# Altium schematic sheet Sheet2.SchDoc
size A; SheetNumber: 2; SheetTotal: 2
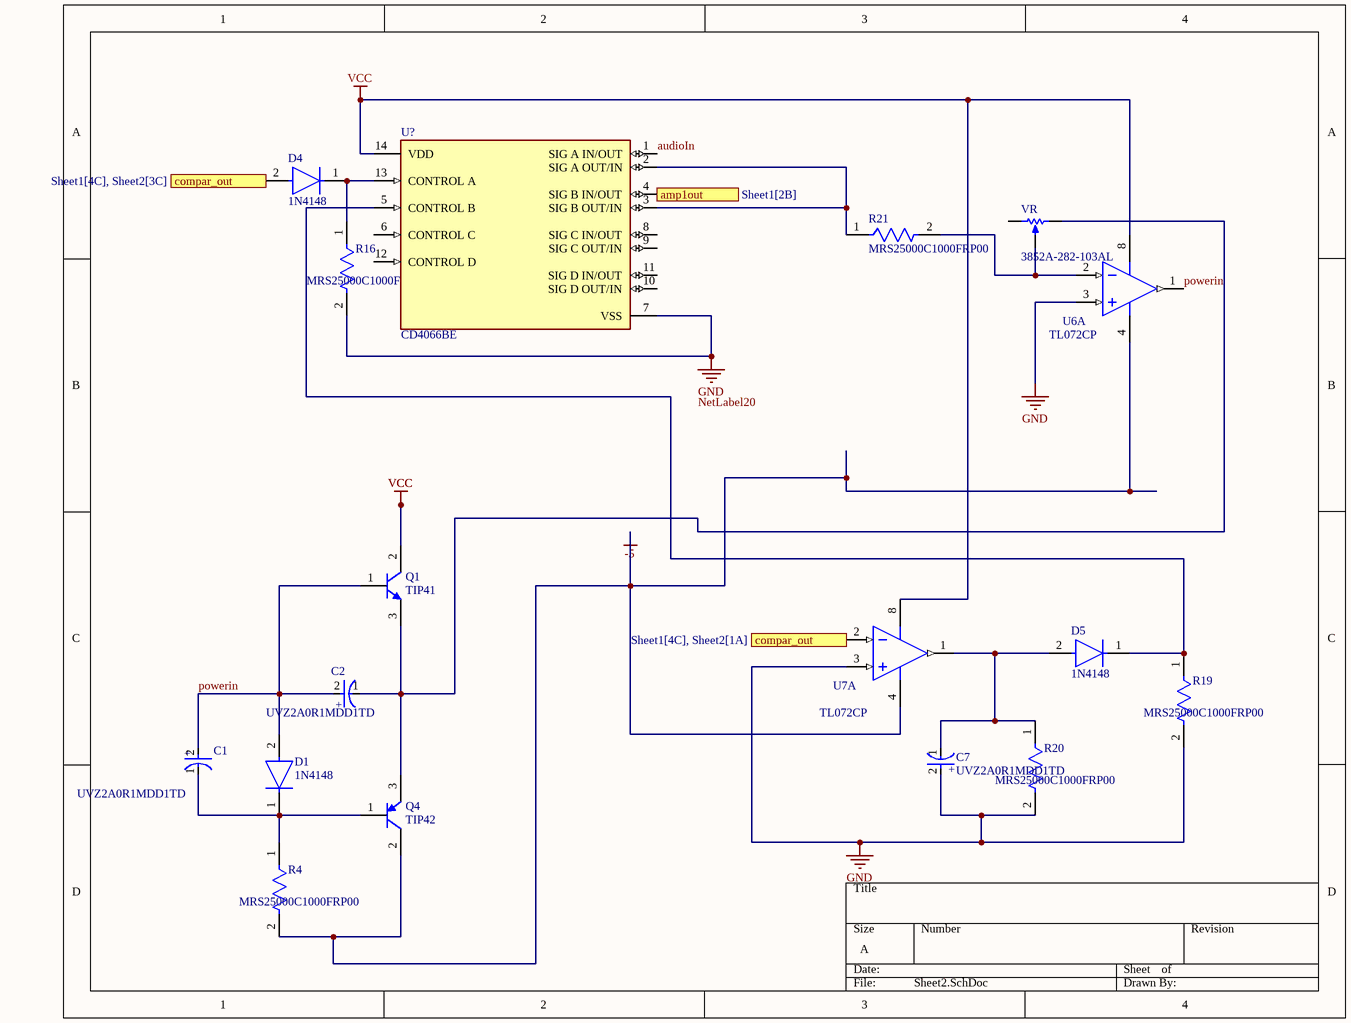
[diagram p0: Sheet2.SchDoc]

## Parts
C1  UVZ2A0R1MDD1TD  [FP-UVZ2A0R1MDD1TD-MFG]
C2  UVZ2A0R1MDD1TD  [FP-UVZ2A0R1MDD1TD-MFG]
C7  UVZ2A0R1MDD1TD  [FP-UVZ2A0R1MDD1TD-MFG]
D1  1N4148  [FP-017AG-MFG]
D4  1N4148  [FP-017AG-MFG]
D5  1N4148  [FP-017AG-MFG]
Q1  TIP41  [ONSC-TO-220-3-221A-09]
Q4  TIP42  [ONSC-TO-220-3-221A-09]
R4  MRS25000C1000FRP00  [FP-MRS25-MFG]
R16  MRS25000C1000FRP00  [FP-MRS25-MFG]
R19  MRS25000C1000FRP00  [FP-MRS25-MFG]
R20  MRS25000C1000FRP00  [FP-MRS25-MFG]
R21  MRS25000C1000FRP00  [FP-MRS25-MFG]
U6  TL072CP  [P0008A]  (part A of 2)
U7  TL072CP  [P0008A]  (part A of 2)
U?  CD4066BE  [FP-N0014A-MFG]
VR  3852A-282-103AL  [BOUR-3852A-282-103AL-3_V]

## Ports
amp1out (in, see Sheet1[2B]), compar_out (in, see Sheet1[4C], Sheet2[1A]), compar_out (in, see Sheet1[4C], Sheet2[3C])

## Nets
-5: Q4.2(C) R4.2 U6.4(VCC-) U7.4(VCC-)
GND: C7.2(A) R16.2 R19.2 R20.2 U6.3(IN1+) U7.3(IN1+) U?.7(VSS)
VCC: Q1.2(C) U6.8(VCC+) U7.8(VCC+) U?.14(VDD)
amp1out: U?.4(SIG_B_IN/OUT) ; port amp1out
audioIn: U?.1(SIG_A_IN/OUT)
compar_out: D4.2(A) U7.2(IN1-) ; port compar_out
powerin: C1.2(A) C2.2(A) D1.2(A) Q1.1(B) U6.1(OUT1)
NetC1_1: C1.1(C) D1.1(C) Q4.1(B) R4.1
NetC2_1: C2.1(C) Q1.3(E) Q4.3(E) VR.3(CW)
NetC7_1: C7.1(C) D5.2(A) R20.1 U7.1(OUT1)
NetD4_1: D4.1(C) R16.1 U?.13(CONTROL_A)
NetD5_1: D5.1(C) R19.1 U?.5(CONTROL_B)
NetR21_1: R21.1 U?.2(SIG_A_OUT/IN) U?.3(SIG_B_OUT/IN)
NetR21_2: R21.2 U6.2(IN1-) VR.2(S)

Not connected (* = marked no-connect by the designer): U? 6(CONTROL_C) 8(SIG_C_IN/OUT) 9(SIG_C_OUT/IN) 10(SIG_D_OUT/IN) 11(SIG_D_IN/OUT) 12(CONTROL_D); VR 1(CCW)

## Notes on the sheet
- Labels drawn without touching a wire or pin: NetLabel20
- (in symbol CMP-00267-12792183-1) +

## Library data of the parts
C1 C2 C7 = CMP-00267-12792183-1: UVZ2A0R1MDD1TD Cap Alum 0.1UF 20% 100V Radial; Capacitance: 100nF; Leakage Current: 300nA; Ripple Current: 1.5mA; Dielectric Material: Aluminium; Life (Hours): 1000hours; Dissipation Factor: 8%; Voltage Rating: 100V; Height: 11mm; Tolerance: 20%; Mount: Through Hole; Case/Package: Radial; Voltage Rating (DC): 100V; NexarPartId: 12792183; Number of Pins: 2; Max Operating Temperature: 105°C; Height - Seated (Max): 12.4968mm; Diameter: 5mm; RoHS: Compliant; Lead Pitch: 2.0066mm; Min Operating Temperature: -55°C
D1 D4 D5 = CMP-07163-000046-1: DIODE GEN PURP 100V 200MA DO35; Forward Voltage: 1V; Max Power Dissipation: 500mW; Max Reverse Current: 5uA; Forward Current: 300mA; Current: 4A; Reverse Recovery Time: 4ns; Element Configuration: Single; Outside Diameter: 1.85mm; Capacitance: 4pF; Polarity: Standard; Max Forward Surge Current (Ifsm): 1A; Reverse Voltage: 100V; Output Current: 200mA; Average Rectified Current: 200mA; Diameter: 1.91mm; Max Repetitive Reverse Voltage (Vrrm): 100V; Current Rating: 200mA; Case/Package: DO-35; Lead Free: Lead Free; Number of Pins: 2; Recovery Time: 4ns; Packaging: Bulk; Contact Plating: Tin; Voltage: 100V; Mount: Through Hole; Max Surge Current: 4A; Package Quantity: 2000; Width: 1.91mm; Max Reverse Voltage (DC): 100V; Length: 4.56mm; Radiation Hardening: No; Power Dissipation: 500mW; Voltage Rating (DC): 100V; Peak Non-Repetitive Surge Current: 4A; REACH SVHC: No SVHC; Height: 4.56mm; Max Operating Temperature: 175°C; Series: -; Weight: 0.01lb; Min Operating Temperature: -65°C
Q1 = CMP-1048-01097-1: Complementary Silicon Plastic Power Transistor, 3-Pin TO-220, Tube; Manufacturer: On Semiconductor; IC Continuous (A): 6; Note1: 0; fT Min (MHz): 3; Polarity: NPN; ComponentLink1Description: Manufacturer URL; ComponentLink3Description: Package Specification; ComponentLink2Description: Datasheet; ComponentLink1URL: http://www.onsemi.com/; PartNumber: TIP41; PackageReference: TO-220-3-221A-09; Packing: Tube; Mounting Technology: Through Hole; PackageDescription: 3-Pin Flange Mount, Vertical Straight Lead, Body 9.97 x 4.445 mm, Pitch 2.54 mm; ComponentLink2URL: http://www.onsemi.com/pub_link/Collateral/TIP41A-D.PDF; ComponentLink3URL: http://www.onsemi.com/pub_link/Collateral/221A-09.PDF; DatasheetVersion: Rev. 10; PackageVersion: Rev. AG, 09/2011; RoHS: FALSE
Q4 = CMP-1048-01181-1: Complementary Silicon Plastic Power Transistor, 3-Pin TO-220, Tube; Manufacturer: On Semiconductor; Polarity: PNP; fT Min (MHz): 3; IC Continuous (A): 6; PackageReference: TO-220-3-221A-09; ComponentLink3Description: Package Specification; PartNumber: TIP42; ComponentLink2URL: http://www.onsemi.com/pub_link/Collateral/TIP41A-D.PDF; PackageDescription: 3-Pin Flange Mount, Vertical Straight Lead, Body 9.97 x 4.445 mm, Pitch 2.54 mm; Mounting Technology: Through Hole; DatasheetVersion: Rev. 10; RoHS: FALSE; ComponentLink1Description: Manufacturer URL; ComponentLink2Description: Datasheet; ComponentLink1URL: http://www.onsemi.com/; ComponentLink3URL: http://www.onsemi.com/pub_link/Collateral/221A-09.PDF; PackageVersion: Rev. AG, 09/2011; Packing: Tube
R4 R16 R19-R21 = CMP-00030-42757237-1: MRS25000C1000FRP00 Resistor, 100 Ohm, ± 1%, 600 mW, Axial Leaded, Metal Film (Thin Film), Professional; Max Power Dissipation: 600mW; Resistance: 100Ω; Voltage Rating: 350V; Temperature Coefficient: 50ppm/°C; Lead Diameter: 600µm; RoHS: Compliant; Radiation Hardening: No; Schedule B: 8533210090, 8533210090; Length: 6.5mm; Packaging: Tape & Reel (TR); Number of Terminations: 2; Mount: Through Hole; Width: 2.5mm; Tolerance: 1%; Military Standard: Not; Voltage Rating (DC): 350V; Contact Plating: Tin; Number of Pins: 2; Max Operating Temperature: 155°C; NexarPartId: 42757237; Diameter: 2.5mm; Composition: Metal Film, Thin Film; REACH SVHC: Unknown; Power Rating: 600mW; Lead Free: Lead Free; Termination: Axial; Case/Package: Axial; Min Operating Temperature: -55°C
U6 U7 = CMP-0017-00950-2: Dual Low-Noise JFET-Input General-Purpose Operational Amplifier, 7 to 36 V, 0 to 70 degC, 8-pin DIP (P8), Pb-Free (RoHS); Manufacturer: Texas Instruments; Sub Family: General Purpose Amplifier, High Supply Voltage Amplifier (>=30V); Total Supply Voltage(Max)(+5V is 5, +/-5V is 10): 36; Slew Rate(Typ)(V/us): 13; Vn at 1kHz(Typ)(nV/rtHz): 18; GBW(Typ)(MHz): 3; CMRR(Min)(dB): 70; Total Supply Voltage(Min)(+5V is 5, +/-5V is 10): 7; Vio (25C)(Max)(mV): 10; Rating: Catalog; IIB(Max)(pA): 200; Iq per channel(Max)(mA): 2.5; Number of Channels: 2; Mounting Technology: Through Hole; ComponentLink3Description: Package Specification; PartNumber: TL072CP; PackageVersion: 4040082/E, 04/2010; Eco-Plan: Pb-Free (RoHS); DatasheetVersion: SLOS080J; Offset Drift(Typ)(uV/C): 18; ComponentLink3URL: http://www.ti.com/litv/pdf/mpdi001b; PackageDescription: 8-Pin Plastic In-Line, Body 9.59 x 6.35 mm, Pitch 2.54 mm; Code_JEDEC: MS-001; ComponentLink2URL: http://www.ti.com/lit/ds/symlink/tl072.pdf; ComponentLink1Description: Manufacturer URL; ComponentLink2Description: Datasheet; ComponentLink1URL: http://www.ti.com/; PackageReference: P0008A
U? = CMP-1574-00014-4: QUAD BILATERAL SWITCH 14-DIP; Manufacturer: Texas Instruments; Frequency: 40MHz; Logic Function Desc: Non-Inverting; Number Of Outputs: 2; Number Of Inputs: 3; Nominal Supply Current: 0.01-0.02uA; Propagation Delay: 7-20ns; Number Of Circuits: 4; Min Supply Voltage: 3V; Standoff Height: 0.51mm; Max Supply Voltage: 18V; Device Class L3: Multiplexers; Digikey Description: QUAD BILATERAL SWITCH 14-DIP; Mouser Description: Switch, Bilateral; PDIP; Quad Bilateral Switch Logic; 18 (max.)v; -55; +125; Ipc Land Pattern Name: DIP794W46P254L1930H508Q14; RoHS: TRUE; Octopart: https://octopart.com/cd4066be-texas+instruments-3103; Category: IC; Automotive: No; ComponentLink2Description: Datasheet; Device Class L2: Logic ICs; Package: N0014A; Temperature Range High: +125°C; Temperature Range Low: -55°C; Lead Free: Yes; Device Class L1: Integrated Circuits (ICs); ComponentLink2URL: http://www.ti.com/lit/ds/symlink/cd4066b.pdf; Ambient Temperature Range Low: -55°C; Manufacturer Part Number: CD4066BE; Temperature: -55°C to +125°C; Ambient Temperature Range High: +125°C; Height: 5.08mm
VR = CMP-2000-05079-1: Diameter Panel Control, 10 KOhm, +/- 10%, 2 W, -1 to 125 degC, 3-Pin THD, RoHS, Bulk; Manufacturer: Bourns; Temperature Coefficient: ±150ppm/degC; Number of Gangs: 1; Other Names: 3852A282103AL; Actuator Length: 0.875"(22.23mm); Resistive Material: Cermet; PCN Design/Specification: PBTResinJun/2011; Rotation: 280deg; PCN Other: MultipleChanges01/Dec/2012; Catalog Drawings: 3852SeriesSide1 / 3852SeriesSide2; Online Catalog: 3852and3856Series; Associated Product: 36-8560-ND / -KNOBINSTRUMW/DIALRND.9"DIA / 36-8555-ND / -KNOBINSTRUMSKIRTEDRND.7"DIA / 36-8556-ND / -KNOBINSTRUMSKIRTEDRND.9"DIA / 36-8565-ND / -KNOBINSTRUMDBLBARRND.7"DIA / 36-8566-ND / -KNOBINSTRUMDBLBARRND.9"DIA / 36-8568-ND / -KNOBINSTRUMSGLBARRND.7"DIA / 36-8569-ND / -KNOBINSTRUMSGLBARRND.9"DIA / 36-8559-ND / -KNOBINSTRUMW/DIALRND.7"DIA / 226-1006-ND / -KNOBBLKGLOSS.75"DIA.250"SHAFT / 226-1007-ND / -KNOBBLKGLOSS.925"DIA.250"SHAFT / 226-1011-ND / -KNOBBLKGLOS; Actuator Diameter: 0.250"(6.35mm); Built in Switch: None; Resistance (Ohms): 10k; Power (Watts): 2W; Actuator Type: Slotted; Standard Package: 45; Tolerance: ±10%; Taper: Linear; Series: 3852; Packaging: Bulk; Category: Potentiometers,VariableResistors; Bushing Thread: 3/8-32; Datasheet URL: https://datasheet.ciiva.com/11831/0900766b80f93b4b-11831016.pdf; Datasheet Version: Sep-14; Number of Turns: 1; Family: RotaryPotentiometers,Rheostats; Termination Style: SolderLug; RoHS Information: 3852A-LMaterialDeclaration; Mounting Type: PanelMount; Manufacturer URL: http://www.bourns.com/